# Altium project TIDA-01349-Interlock-Card.PrjPcb
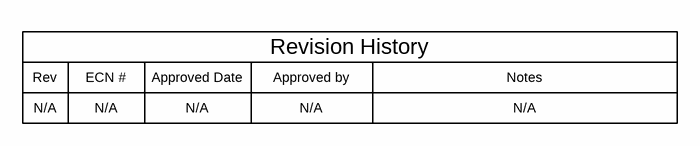
[diagram p0: TIDA-01349-Interlock-Card_CoverSheet.SchDoc]
TID: 01349; TechSupport: http://www.ti.com/support; SCH_Rev: E1; PRJ_Title: PWM Interlock Card; PRJ_Number: TIDA-01349; PRJ_Engineer: PN; PRJ_Customer: Public Release; PCB_Rev: E1; EVM_Orderable: NA; CopyrightYear: 2017
3 sheets, 22 parts. Net scope: global (net labels, ports and power ports of the same name join across sheets).
Board file: TIDA-01349-Interlock-Card_PCB.PcbDoc
Sheets:
  TIDA-01349-Interlock-Card_CoverSheet.SchDoc
  TIDA-01349-Interlock-Card.SchDoc
  TIDA-01349-Interlock-Card_EVM_Hardware.SchDoc

## Sheet TIDA-01349-Interlock-Card_CoverSheet.SchDoc: Coversheet
size 431 x 279 mm; Date: Not shown in title block; ApprovedBy: Not shown in title block; CheckedBy: Not shown in title block; Author: Not shown in title block; CompanyName: Not shown in title block; Engineer: Not shown in title block; Organization: Not shown in title block; Address1: Not shown in title block; Address2: Not shown in title block; Address3: Not shown in title block; Address4: Not shown in title block; DocumentNumber: 1; Revision: Use project parameter SCH_Rev; SheetNumber: 1; SheetTotal: 3; PageSetup: Record=PageOptions|CenterHorizontal=True|CenterVertical=True|PrintScale=1.00|XCorrection=1.00|YCorrection=1.00|PrintKind=0|BorderSize=5000000|LeftOffset=0|BottomOffset=0|Orientation=2|PaperLength=1000|PaperWidth=1000|Scale=100|PaperSource=15|PrintQuality=600|MediaType=1|DitherType=10|PaperKind=Letter|PrintScaleMode=1; CurrentTime: Not shown in title block; CurrentDate: Not shown in title block; Time: Not shown in title block; DocumentFullPathAndName: Not shown in title block; DocumentName: Not shown in title block; ModifiedDate: Not shown in title block; ImagePath: Not shown in title block

### Notes on the sheet
- Rev
- N/A
- ECN #
- Approved Date
- Approved by
- Revision History
- Notes
- Drawn By:
- SVN Rev:
- Number:
- TID #:
- Orderable:
- Rev:
- Sheet Title:
- File:
- Project Title:
- Designed for:
- Assembly Variant:
- Mod. Date:
- Sheet:
- Size:
- of
- B
- http://www.ti.com
- Texas Instruments and/or its licensors do not warrant the accuracy or completeness of this specification or any information contained therein. Texas Instruments and/or its licensors do not warrant that this design will meet the specifications, will be suitable for your application or fit for any particular purpose, or will operate in an implementation. Texas Instruments and/or its licensors do not warrant that the design is production worthy. You should completely validate and test your design implementation to confirm the system functionality for your application.
- Engineer:
- Contact:
- © Texas Instruments

## Sheet TIDA-01349-Interlock-Card.SchDoc: Interlock Circuit
size 431 x 279 mm; Date: Not shown in title block; ApprovedBy: Not shown in title block; CheckedBy: Not shown in title block; Author: Not shown in title block; CompanyName: Not shown in title block; Engineer: Not shown in title block; Organization: Not shown in title block; Address1: Not shown in title block; Address2: Not shown in title block; Address3: Not shown in title block; Address4: Not shown in title block; DocumentNumber: 1; Revision: Use project parameter SCH_Rev; SheetNumber: 2; SheetTotal: 3; PageSetup: Record=PageOptions|CenterHorizontal=True|CenterVertical=True|PrintScale=1.00|XCorrection=1.00|YCorrection=1.00|PrintKind=0|BorderSize=5000000|LeftOffset=0|BottomOffset=0|Orientation=2|PaperLength=1000|PaperWidth=1000|Scale=100|PaperSource=15|PrintQuality=600|MediaType=1|DitherType=10|PaperKind=Letter|PrintScaleMode=1; CurrentTime: Not shown in title block; CurrentDate: Not shown in title block; Time: Not shown in title block; DocumentFullPathAndName: Not shown in title block; DocumentName: Not shown in title block; ModifiedDate: Not shown in title block; ImagePath: Not shown in title block
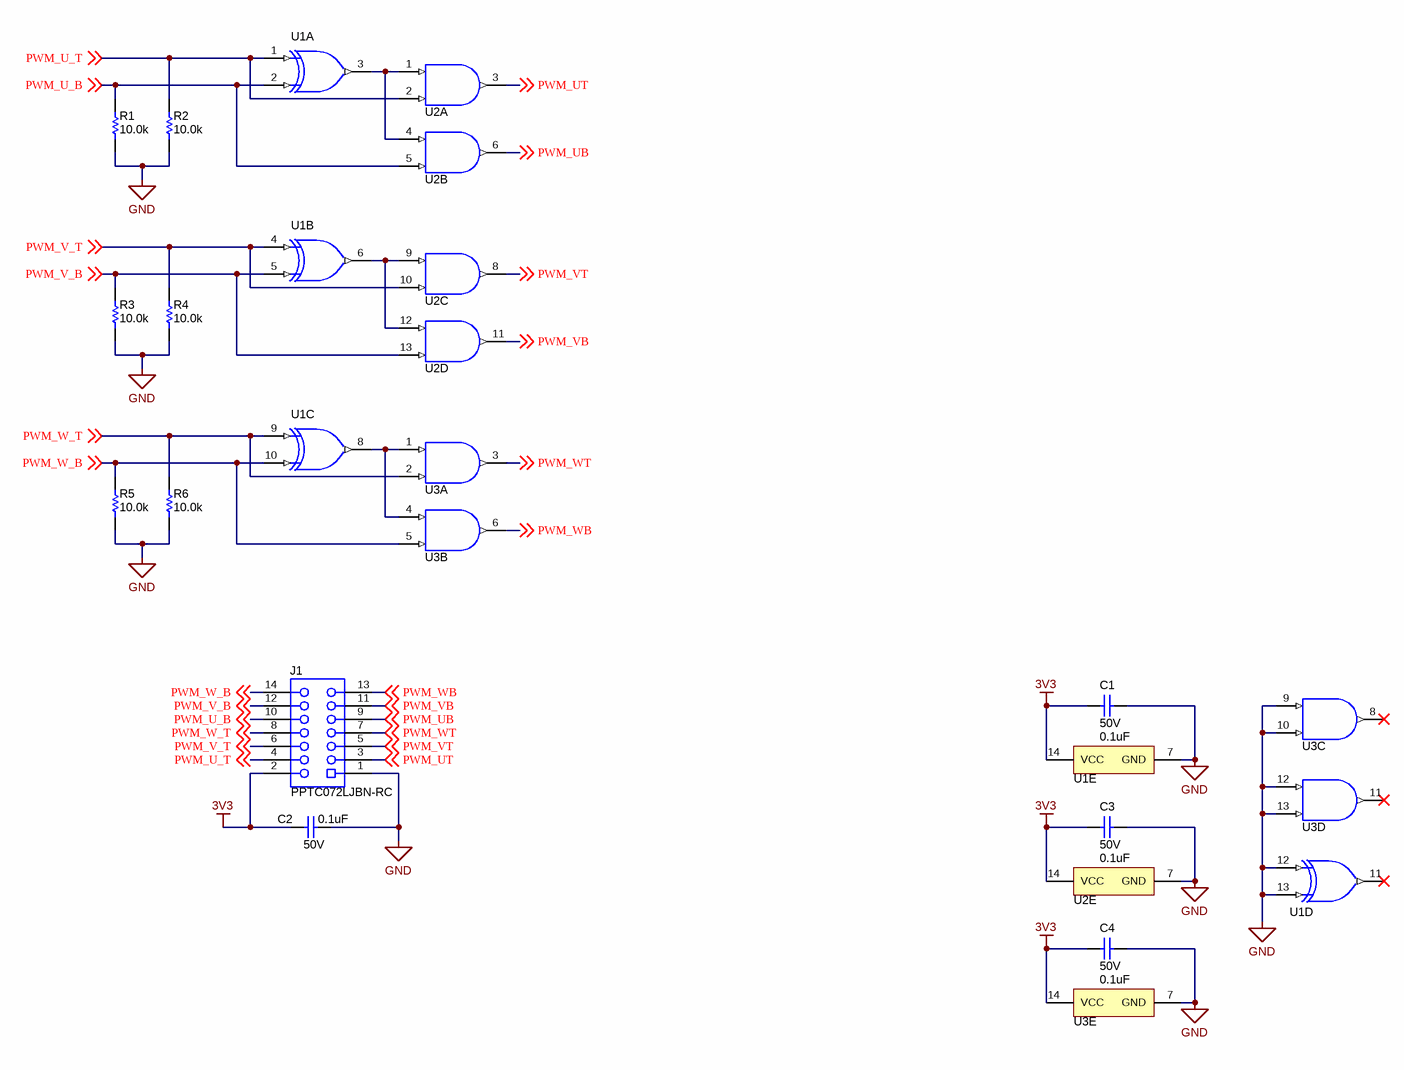
[diagram p1: TIDA-01349-Interlock-Card.SchDoc]

### Parts
(Parts that share a designator on the sheet are numbered #1, #2 ... from top to bottom, then left to right.)
C1  VDC_V: 50V  ValueDisplayed: 0.1uF  [0603]  (hidden comment: C0603C104K5RACTU)
C2  VDC_V: 50V  ValueDisplayed: 0.1uF  [0603]  (hidden comment: C0603C104K5RACTU)
C3  VDC_V: 50V  ValueDisplayed: 0.1uF  [0603]  (hidden comment: C0603C104K5RACTU)
C4  VDC_V: 50V  ValueDisplayed: 0.1uF  [0603]  (hidden comment: C0603C104K5RACTU)
J1  PPTC072LJBN-RC  [Sullins_xPxC072LJBN]
R1  ValueDisplayed: 10.0k  [0402]  (hidden comment: CRCW040210K0FKED)
R2  ValueDisplayed: 10.0k  [0402]  (hidden comment: CRCW040210K0FKED)
R3  ValueDisplayed: 10.0k  [0402]  (hidden comment: CRCW040210K0FKED)
R4  ValueDisplayed: 10.0k  [0402]  (hidden comment: CRCW040210K0FKED)
R5  ValueDisplayed: 10.0k  [0402]  (hidden comment: CRCW040210K0FKED)
R6  ValueDisplayed: 10.0k  [0402]  (hidden comment: CRCW040210K0FKED)
U1#1  SN74LVC86APW  [PW0014A_N]  (value not drawn)  (part A of 5)
U1#2  SN74LVC86APW  [PW0014A_N]  (value not drawn)  (parts B,C,D,E of 5)
U2#1  SN74LVC08APW  [PW0014A_N]  (value not drawn)  (part A of 5)
U2#2  SN74LVC08APW  [PW0014A_N]  (value not drawn)  (parts B,C,D,E of 5)
U3  SN74LVC08APW  [PW0014A_N]  (value not drawn)  (parts A,B,C,D,E of 5)

### Nets
3V3: C1.2 C2.2 C3.2 C4.2 J1.2 U1#2.14(VCC) U2#2.14(VCC) U3.14(VCC)
GND: C1.1 C2.1 C3.1 C4.1 J1.1 R1.1 R2.1 R3.1 R4.1 R5.1 R6.1 U1#2.7(GND) U1#2.12(4A) U1#2.13(4B) U2#2.7(GND) U3.7(GND) U3.9(3A) U3.10(3B) U3.12(4A) U3.13(4B)
PWM_U_B: J1.10 R1.2 U1#1.2(1B) U2#2.5(2B) ; off-sheet PWM_U_B
PWM_U_T: J1.4 R2.2 U1#1.1(1A) U2#1.2(1B) ; off-sheet PWM_U_T
PWM_UB: J1.9 U2#2.6(2Y) ; off-sheet PWM_UB
PWM_UT: J1.3 U2#1.3(1Y) ; off-sheet PWM_UT
PWM_V_B: J1.12 R3.2 U1#2.5(2B) U2#2.13(4B) ; off-sheet PWM_V_B
PWM_V_T: J1.6 R4.2 U1#2.4(2A) U2#2.10(3B) ; off-sheet PWM_V_T
PWM_VB: J1.11 U2#2.11(4Y) ; off-sheet PWM_VB
PWM_VT: J1.5 U2#2.8(3Y) ; off-sheet PWM_VT
PWM_W_B: J1.14 R5.2 U1#2.10(3B) U3.5(2B) ; off-sheet PWM_W_B
PWM_W_T: J1.8 R6.2 U1#2.9(3A) U3.2(1B) ; off-sheet PWM_W_T
PWM_WB: J1.13 U3.6(2Y) ; off-sheet PWM_WB
PWM_WT: J1.7 U3.3(1Y) ; off-sheet PWM_WT
NetU1#1_3: U1#1.3(1Y) U2#1.1(1A) U2#2.4(2A)
NetU1#2_6: U1#2.6(2Y) U2#2.9(3A) U2#2.12(4A)
NetU1#2_8: U1#2.8(3Y) U3.1(1A) U3.4(2A)

Not connected (* = marked no-connect by the designer): U1#2 11(4Y)*; U3 8(3Y)* 11(4Y)*

### Notes on the sheet
- Drawn By:
- SVN Rev:
- Number:
- TID #:
- Orderable:
- Rev:
- Sheet Title:
- File:
- Project Title:
- Designed for:
- Assembly Variant:
- Mod. Date:
- Sheet:
- Size:
- of
- B
- http://www.ti.com
- Texas Instruments and/or its licensors do not warrant the accuracy or completeness of this specification or any information contained therein. Texas Instruments and/or its licensors do not warrant that this design will meet the specifications, will be suitable for your application or fit for any particular purpose, or will operate in an implementation. Texas Instruments and/or its licensors do not warrant that the design is production worthy. You should completely validate and test your design implementation to confirm the system functionality for your application.
- Engineer:
- Contact:
- © Texas Instruments

### Library data of the parts
C1-C4 = CMP-0006861-2: CAP, CERM, 0.1 uF, 50 V, +/- 10%, X7R, 0603; Manufacturer: Kemet; TaMin_C: -55°C; Polarized: N; SizeAreaWB_mm2: 4.68; Value1: Unknown; U/M: EA; Value: 0.1uF; TaMax_C: 125°C; SizeZ_mm: 1; SizeX_mm: 1.6; SizeY_mm: 0.8; SizeArea_mm2: 1.28; Cap_F: 100nF; AEC Category: Q200; Supplier Part Number 2: 80-C0603C104K5R; Publisher: Texas Instruments; Supplier 2: Mouser; Supplier Part Number 3: 1288255; TempCo: X7R; Supplier 3: Farnell; Published: 2008-06-19; RoHS: Y; MountType: SMT; Supplier 1: Digi-Key; PackageReference: 0603; Tolerance_%: 10%; Cap_Case: 0603; Value2: 50V; CompType: Capacitor; LatestRevisionDate: 2017-03-09; PartNumber: C0603C104K5RACTU; AEC Qualified: ?; ComponentLink1Description: Datasheet link; Supplier Part Number 1: 399-5089-1-ND; Technology: Ceramic; ComponentLink1URL: http://www.kemet.com/kemet/web/homepage/kechome.nsf/vapubfiles/F3102_Y5V.pdf/$file/F3102_Y5V.pdf
J1 = CMP-0054673-1: Receptacle, 2.54mm, 7x2, Tin, Black, R/A, TH; Manufacturer: Sullins Connector Solutions; CNHeader: FALSE; Current_A: 3A; Gender: Female; Voltage_V: 250V; CompType: Socket Strip; Row_Count: 2; RowSpacing_mm: 2.54; CT: TRUE; Cert_UL: Y; ComponentLink1URL: http://sullinscorp.com/drawings/101_P(N)PxCxx2LJBN-RC,_10494-H.pdf; Publisher: Texas Instruments; Color: Black; RoHS: Y; MountType: TH; Supplier 1: Digi-Key; PackageReference: Receptacle, 2.54mm, 7x2, R/A, TH; PinCount: 14; LatestRevisionDate: 26/05/2017; PartNumber: PPTC072LJBN-RC; Orientation: R/A; ComponentLink1Description: Datasheet URL; Supplier Part Number 1: S5521-ND; Pitch_mm: 2.54; ContactFinish: Tin
R1-R6 = CMP-0025958-2: RES, 10.0 k, 1%, 0.063 W, 0402; Manufacturer: Vishay-Dale; Power_W: 63mW; TempCo: 100 ppm/C; Value_Code: 10k0; U/M: EA; Value: 10.0k; EIA_Code: E96; Res_ohm: 10k; SizeX_mm: 1; SizeY_mm: 0.5; SizeZ_mm: 0.6; Value2: 0.063W; VDC_V: 50V; AEC Category: Q200; Supplier Part Number 2: 52K6595; Publisher: Texas Instruments; Supplier 2: Newark; Supplier Part Number 3: 71-CRCW0402-10K-E3; Supplier 3: Mouser; Published: 2008-06-26; RoHS: Y; Value1: 1%; MountType: SMT; Supplier 1: Digi-Key; PackageReference: 0402; Tolerance_%: 1%; SizeArea_mm2: 0.5; CompType: Resistor; LatestRevisionDate: 2017-03-09; PartNumber: CRCW040210K0FKED; AEC Qualified: ?; ComponentLink1Description: Datasheet link; Supplier Part Number 1: 541-10.0KLCT-ND; Technology: Thick Film; ComponentLink1URL: http://www.vishay.com/docs/20035/dcrcwe3.pdf
U1#1 U1#2 = CMP-0053460-1: Quadruple 2-Input Exclusive-OR Gate, PW0014A, TUBE; Manufacturer: Texas Instruments; Voltage(Nom)(V): 1.8,2.5,2.7,3.3; Input Type: TTL; Rating: Catalog; ICC @ Nom Voltage(Max)(mA): 0.01; Output Drive (IOL/IOH)(Max)(mA): 24/-24; VCC(Min)(V): 1.65; F @ Nom Voltage(Max)(Mhz): 70; VCC(Max)(V): 3.6; Technology Family: LVC; Schmitt Trigger: No; Bits(#): 4; tpd @ Nom Voltage(Max)(ns): 9.9,7.6,5.6,4.6; PackageReference: PW0014A; DatasheetVersion: SCAS288P; Operating Temperature Range(C): -40 to 125; Generic Part Number: SN74LVC86A; Output Type: TTL; PartId: 1
U2#1 U2#2 U3 = CMP-0054498-1: Quadruple 2-Input Positive-AND Gate, PW0014A, TUBE; Manufacturer: Texas Instruments; Technology Family: LVC; VCC(Max)(V): 3.6; tpd @ Nom Voltage(Max)(ns): 9.8,6.9,4.8,4.1; Output Drive (IOL/IOH)(Max)(mA): -24/24; Output Type: TTL; Schmitt Trigger: No; F @ Nom Voltage(Max)(Mhz): 70; Rating: Catalog; VCC(Min)(V): 1.65; ICC @ Nom Voltage(Max)(mA): 0.01; Bits(#): 4; Voltage(Nom)(V): 1.8,2.5,2.7,3.3; Operating Temperature Range(C): -40 to 125; PackageReference: PW0014A; Input Type: TTL; DatasheetVersion: SCAS283Q; Generic Part Number: SN74LVC08A; PartId: 1

## Sheet TIDA-01349-Interlock-Card_EVM_Hardware.SchDoc: EVM Hardware
size 431 x 279 mm; Date: Not shown in title block; ApprovedBy: Not shown in title block; CheckedBy: Not shown in title block; Author: Not shown in title block; CompanyName: Not shown in title block; Engineer: Not shown in title block; Organization: Not shown in title block; Address1: Not shown in title block; Address2: Not shown in title block; Address3: Not shown in title block; Address4: Not shown in title block; DocumentNumber: 1; Revision: Use project parameter SCH_Rev; SheetNumber: 3; SheetTotal: 3; PageSetup: Record=PageOptions|CenterHorizontal=True|CenterVertical=True|PrintScale=1.00|XCorrection=1.00|YCorrection=1.00|PrintKind=0|BorderSize=5000000|LeftOffset=0|BottomOffset=0|Orientation=2|PaperLength=1000|PaperWidth=1000|Scale=100|PaperSource=15|PrintQuality=600|MediaType=1|DitherType=10|PaperKind=Letter|PrintScaleMode=1; CurrentTime: Not shown in title block; CurrentDate: Not shown in title block; Time: Not shown in title block; DocumentFullPathAndName: Not shown in title block; DocumentName: Not shown in title block; ModifiedDate: Not shown in title block; ImagePath: Not shown in title block
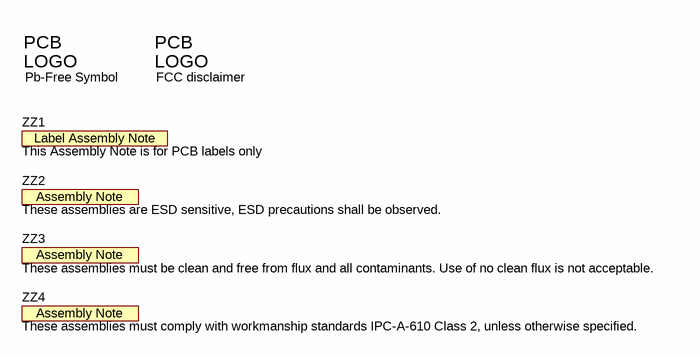
[diagram p2: TIDA-01349-Interlock-Card_EVM_Hardware.SchDoc]

### Parts
Logo2  Pb-Free Symbol  [Pb-Free_Overlay_Small]  (no BOM)
Logo3  FCC disclaimer  [FCC_disclaimer]  (no BOM)
ZZ1  This Assembly Note is for PCB labels only  [AssemblyNoteLabel]  (no BOM)
ZZ2  These assemblies are ESD sensitive, ESD precautions shall be observed.  [AssemblyNote]  (no BOM)
ZZ3  These assemblies must be clean and free from flux and all contaminants. Use of no clean flux is not acceptable.  [AssemblyNote]  (no BOM)
ZZ4  These assemblies must comply with workmanship standards IPC-A-610 Class 2, unless otherwise specified.  [AssemblyNote]  (no BOM)

### Notes on the sheet
- Drawn By:
- SVN Rev:
- Number:
- TID #:
- Orderable:
- Rev:
- Sheet Title:
- File:
- Project Title:
- Designed for:
- Assembly Variant:
- Mod. Date:
- Sheet:
- Size:
- of
- B
- http://www.ti.com
- Texas Instruments and/or its licensors do not warrant the accuracy or completeness of this specification or any information contained therein. Texas Instruments and/or its licensors do not warrant that this design will meet the specifications, will be suitable for your application or fit for any particular purpose, or will operate in an implementation. Texas Instruments and/or its licensors do not warrant that the design is production worthy. You should completely validate and test your design implementation to confirm the system functionality for your application.
- Engineer:
- Contact:
- © Texas Instruments
- (in symbol CMP-0003616-3) Label Assembly Note
- (in symbol CMP-0074839-1) PCB; LOGO
- (in symbol CMP-0074847-1) PCB; LOGO

### Library data of the parts
Logo2 = CMP-0074839-1: SymbolCreator: a0412235; Library Reference: Logo; SymbolVersion: 2011-08-22; Published: 2009-03-03; Publisher: Texas Instruments; LatestRevisionDate: 2017-07-06; Lib Reference: Pb-Free; PartNumber: Pb-Free Symbol
Logo3 = CMP-0074847-1: FCC_disclaimer; Library Reference: Logo; Published: 2009-03-03; Publisher: Texas Instruments; LatestRevisionDate: 2017-07-06; Lib Reference: FCC_disclaimer; PartNumber: FCC disclaimer
ZZ1 = CMP-0003616-3: CompType: AssemblyNote; ClassName: AssemblyNote; Publisher: Texas Instruments; LatestRevisionDate: 2017-03-09; Key: AssemblyNoteLabel
ZZ2 = CMP-0077236-1: CompType: AssemblyNote; ClassName: AssemblyNote; Publisher: Texas Instruments; LatestRevisionDate: 2017-08-10; Key: AssemblyNote
ZZ3 = CMP-0077237-1: CompType: AssemblyNote; ClassName: AssemblyNote; Publisher: Texas Instruments; LatestRevisionDate: 2017-08-10; Key: AssemblyNote
ZZ4 = CMP-0077238-1: CompType: AssemblyNote; ClassName: AssemblyNote; Publisher: Texas Instruments; LatestRevisionDate: 2017-08-10; Key: AssemblyNote

## Assembly variants
001: not fitted FID1 FID2 FID3